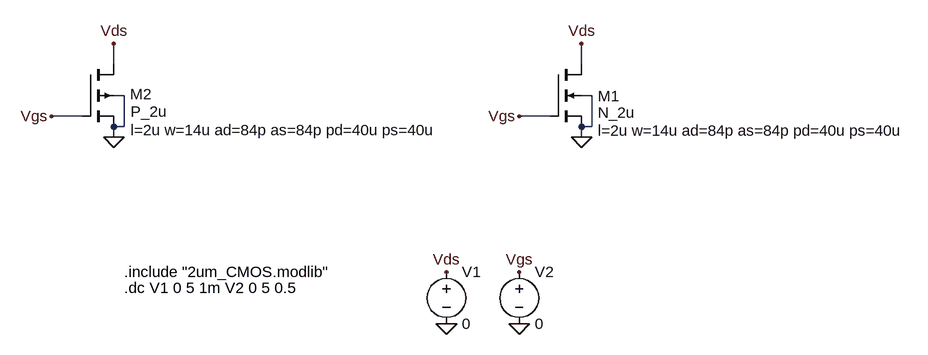
[diagram p0: schematic 1b_1c_nMOS.asc]
1b_1c_nMOS.asc, the LTspice schematic file:
Version 4
SHEET 1 1316 680
WIRE 16 112 16 80
WIRE 736 112 736 80
WIRE 32 160 16 160
WIRE 752 160 736 160
WIRE -32 192 -80 192
WIRE 688 192 640 192
WIRE 32 208 32 160
WIRE 32 208 16 208
WIRE 752 208 752 160
WIRE 752 208 736 208
WIRE 16 224 16 208
WIRE 736 224 736 208
FLAG -80 192 Vgs
FLAG 16 80 Vds
FLAG 736 80 Vds
FLAG 640 192 Vgs
FLAG 16 224 0
FLAG 640 512 0
FLAG 528 512 0
FLAG 528 432 Vds
FLAG 640 432 Vgs
FLAG 736 224 0
SYMBOL nmos4 688 112 R0
WINDOW 0 73 49 Left 2
WINDOW 3 73 74 Left 2
WINDOW 123 73 102 Left 2
SYMATTR InstName M1
SYMATTR Value N_2u
SYMATTR Value2 l=2u w=14u ad=84p as=84p pd=40u ps=40u
SYMBOL pmos4 -32 112 R0
WINDOW 0 73 46 Left 2
WINDOW 3 74 73 Left 2
WINDOW 123 74 101 Left 2
SYMATTR InstName M2
SYMATTR Value P_2u
SYMATTR Value2 l=2u w=14u ad=84p as=84p pd=40u ps=40u
SYMBOL voltage 528 416 R0
WINDOW 123 0 0 Left 0
WINDOW 39 0 0 Left 0
SYMATTR InstName V1
SYMATTR Value 0
SYMBOL voltage 640 416 R0
WINDOW 123 0 0 Left 0
WINDOW 39 0 0 Left 0
SYMATTR InstName V2
SYMATTR Value 0
TEXT 32 432 Left 2 !.include "2um_CMOS.modlib"
TEXT 32 456 Left 2 !.dc V1 0 5 1m V2 0 5 0.5

The netlist it stands for:
* 1b_1c_nMOS.asc
M1 Vds Vgs 0 0 N_2u l=2u w=14u ad=84p as=84p pd=40u ps=40u
M2 Vds Vgs 0 0 P_2u l=2u w=14u ad=84p as=84p pd=40u ps=40u
V1 Vds 0 0
V2 Vgs 0 0
.model NMOS NMOS
.model PMOS PMOS
.lib standard.mos
.include "2um_CMOS.modlib"
.dc V1 0 5 1m V2 0 5 0.5
.backanno
.end